# EasyEDA Pro project ProDoc_双路无刷电调_2025-08-21.epro, schematic Schematic1_1

## Sheets
1 P1: Board Name: Board1_1; Create Date: 2025-06-27; Page Name: P1; Project Name: AI8051U-AM32无刷电调; Schematic Name: Schematic1_1; Update Date: 2025-06-28; Company: 嘉立创EDA; Page Size: A4; Version: V1.0
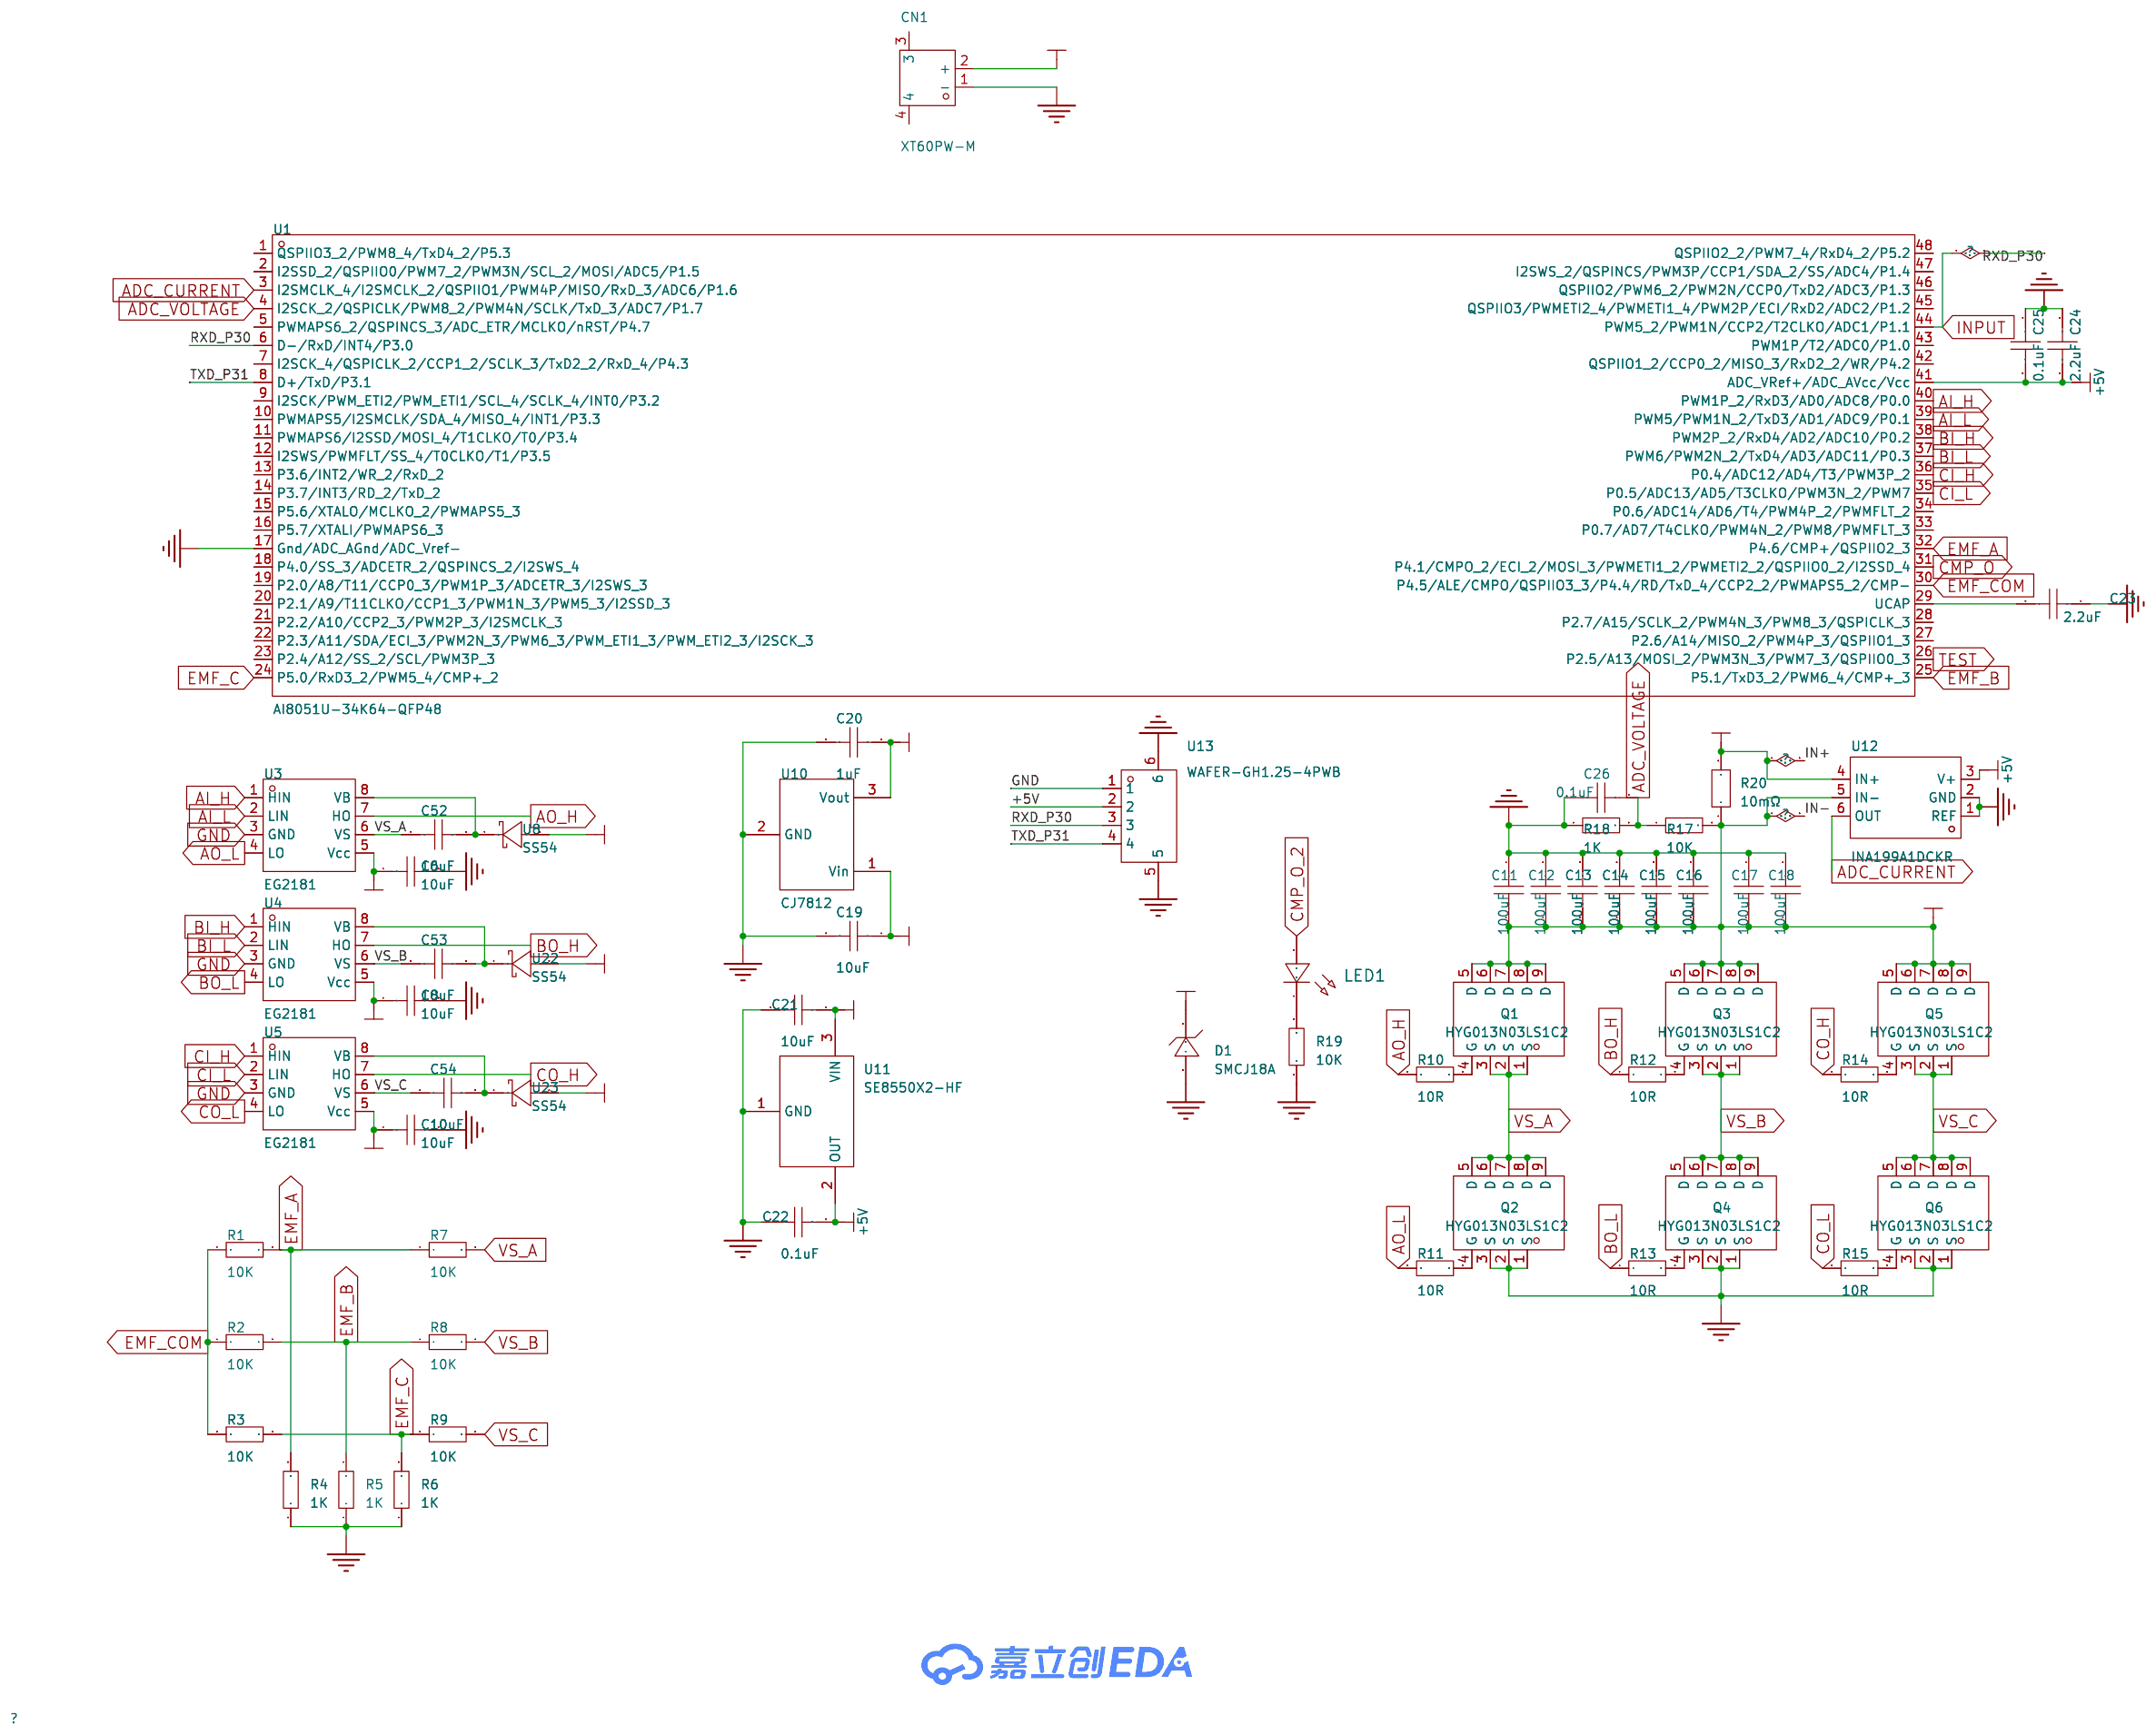
[diagram p0: P1]
2 P2: Page Name: P2
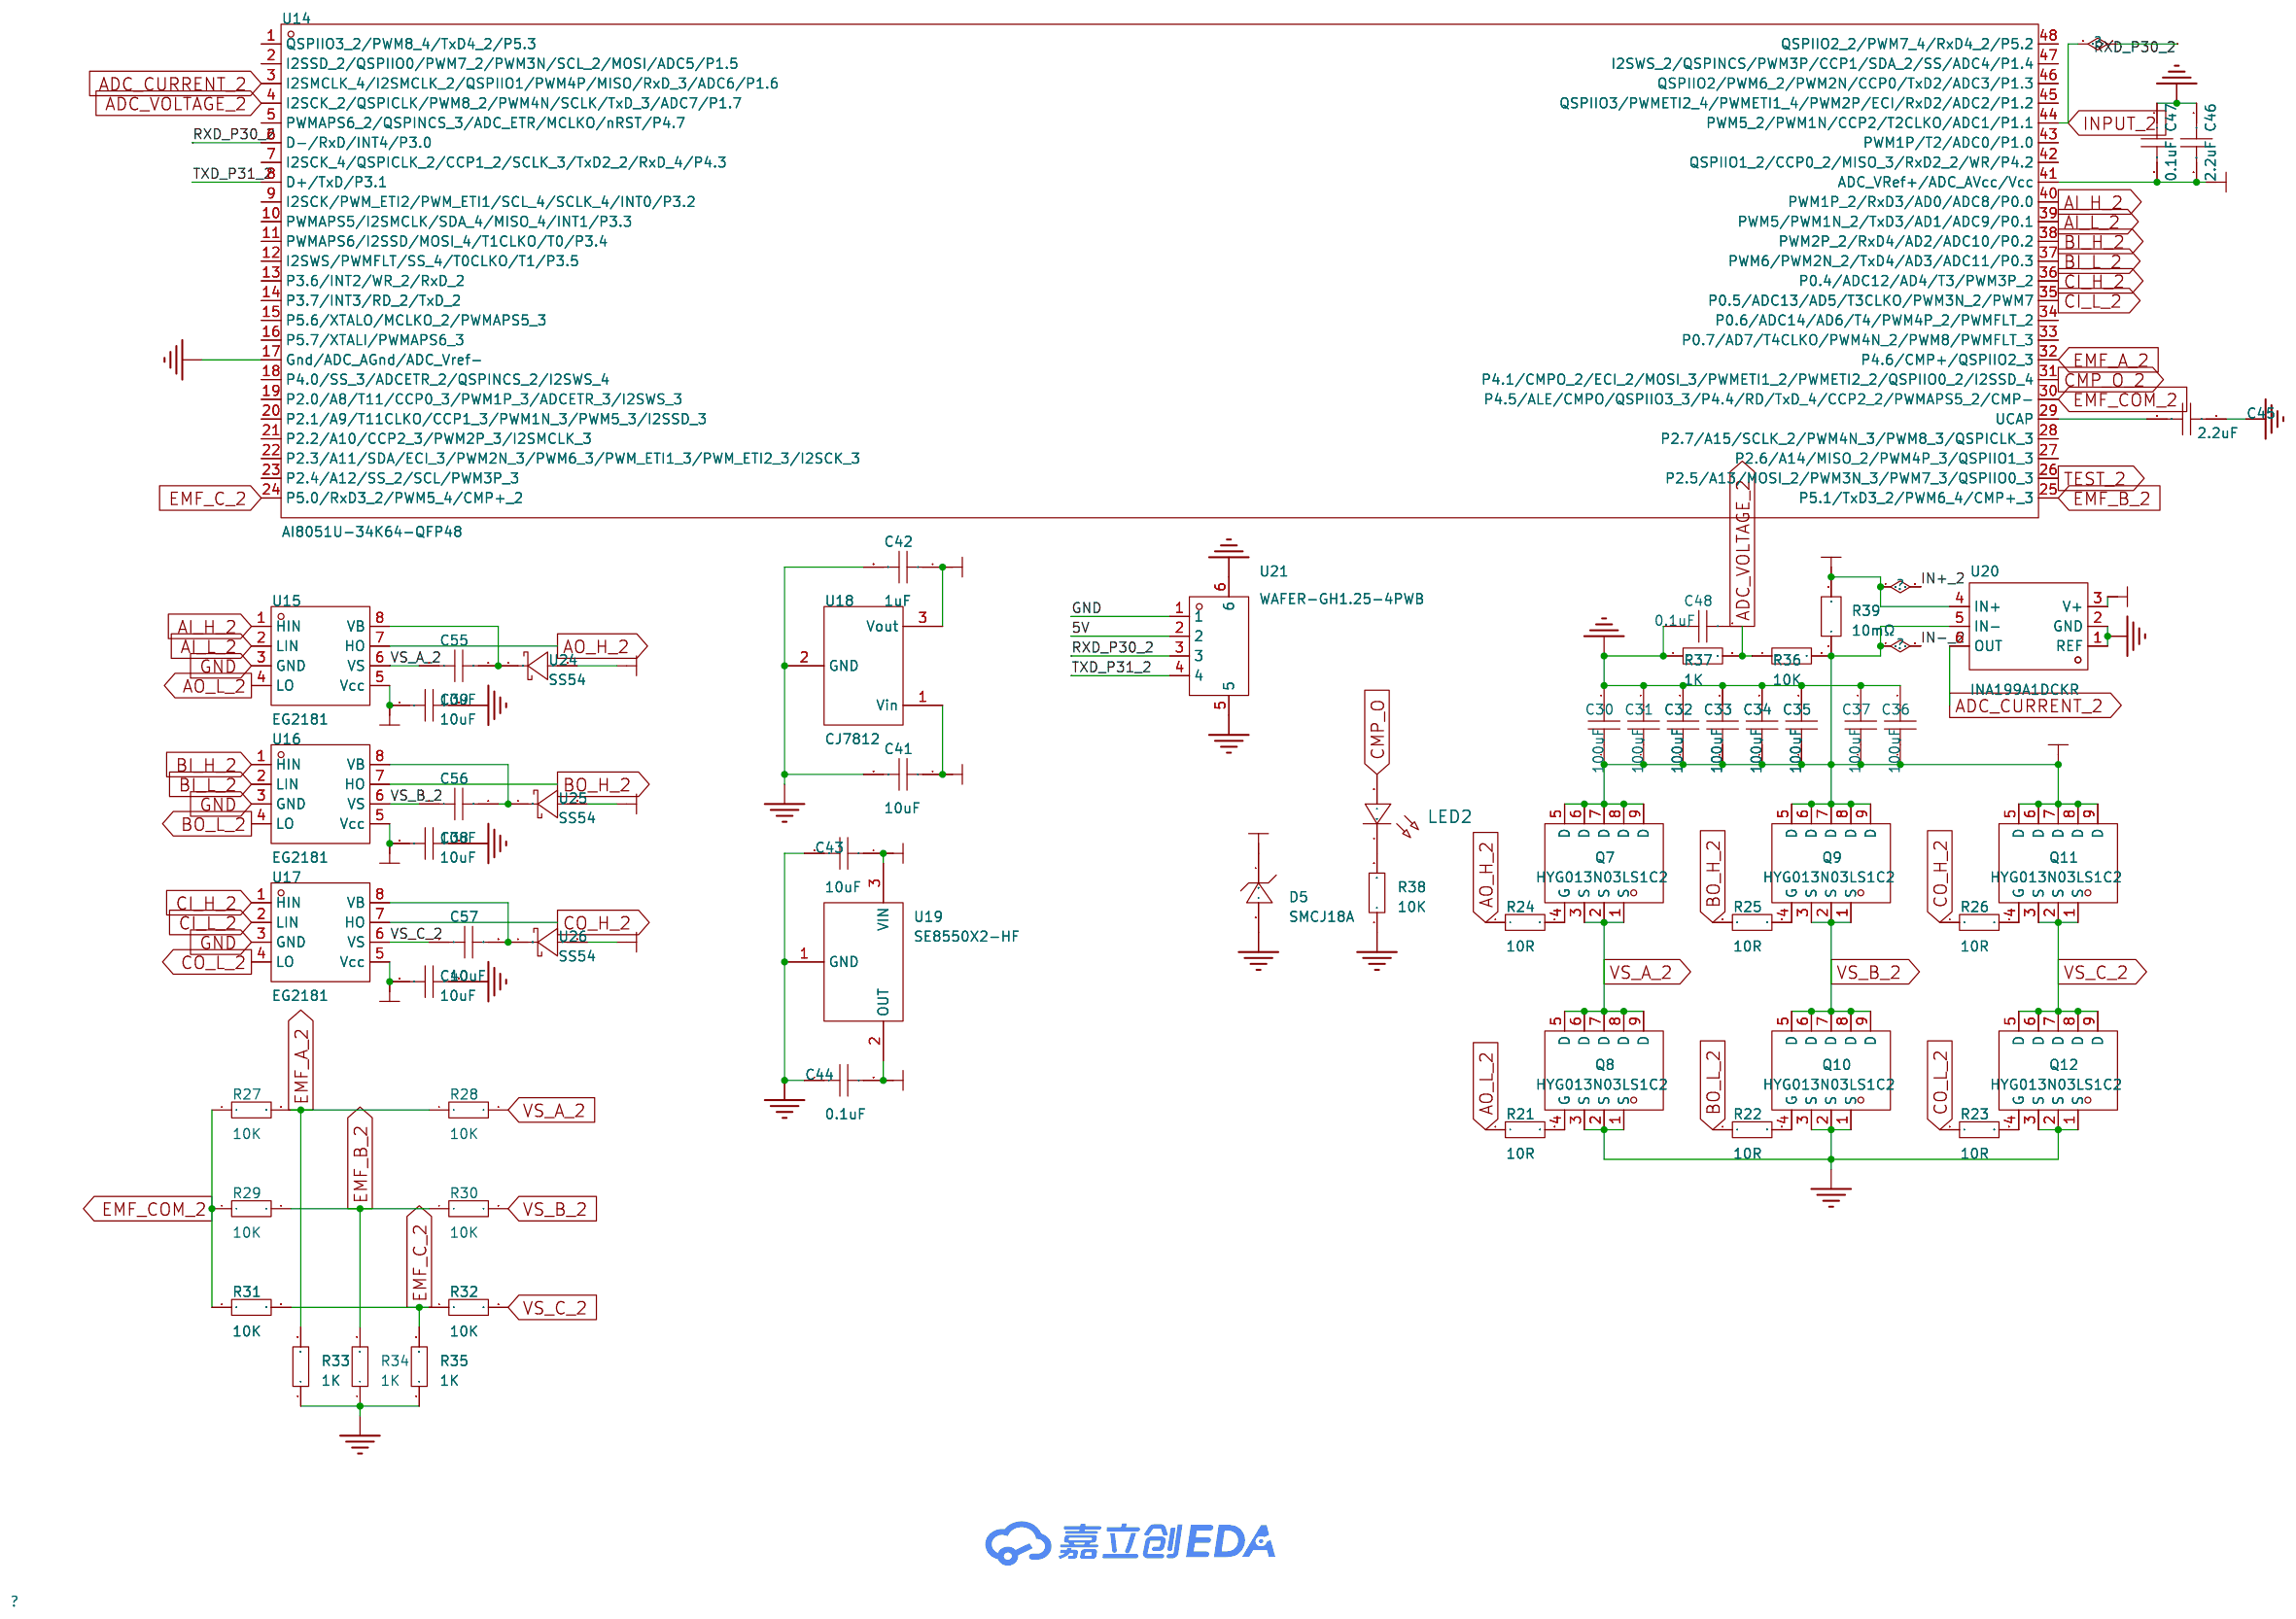
[diagram p1: P2]

## Parts
sheet P1
C6  10uF  [C0603]
C8  10uF  [C0603]
C10  10uF  [C0603]
C11  100uF  [C1206]
C12  100uF  [C1206]
C13  100uF  [C1206]
C14  100uF  [C1206]
C15  100uF  [C1206]
C16  100uF  [C1206]
C17  100uF  [C1206]
C18  100uF  [C1206]
C19  10uF  [C0603]
C20  1uF  [C0603]
C21  10uF  [C0603]
C22  0.1uF  [C0603]
C23  2.2uF  [C0603]
C24  2.2uF  [C0603]
C25  0.1uF  [C0603]
C26  0.1uF  [C0603]
C52  10uF  [C0603]
C53  10uF  [C0603]
C54  10uF  [C0603]
CN1  XT60PW-M  [CONN-TH_XT60PW-M]
D1  SMCJ18A  [SMC_L6.9-W5.9-LS7.9-RD]
LED1  -  [LED_0603]
Q1  HYG013N03LS1C2  [PDFN-8_L5.8-W5.1-P1.27-LS6.1-BL]
Q2  HYG013N03LS1C2  [PDFN-8_L5.8-W5.1-P1.27-LS6.1-BL]
Q3  HYG013N03LS1C2  [PDFN-8_L5.8-W5.1-P1.27-LS6.1-BL]
Q4  HYG013N03LS1C2  [PDFN-8_L5.8-W5.1-P1.27-LS6.1-BL]
Q5  HYG013N03LS1C2  [PDFN-8_L5.8-W5.1-P1.27-LS6.1-BL]
Q6  HYG013N03LS1C2  [PDFN-8_L5.8-W5.1-P1.27-LS6.1-BL]
R1  10K  [R0603]
R2  10K  [R0603]
R3  10K  [R0603]
R4  1K  [R0603]
R5  1K  [R0603]
R6  1K  [R0603]
R7  10K  [R0603]
R8  10K  [R0603]
R9  10K  [R0603]
R10  10R  [R0603]
R11  10R  [R0603]
R12  10R  [R0603]
R13  10R  [R0603]
R14  10R  [R0603]
R15  10R  [R0603]
R17  10K  [R0603]
R18  1K  [R0603]
R19  10K  [R0603]
R20  10mΩ  [RES-SMD_L6.4-W3.2-R2512]
U1  AI8051U-34K64-QFP48  [LQFP-48_L7.0-W7.0-P0.50-LS9.0-BL_1]
U3  EG2181  [SOP-8_L4.9-W3.9-P1.27-LS6.0-BL]
U4  EG2181  [SOP-8_L4.9-W3.9-P1.27-LS6.0-BL]
U5  EG2181  [SOP-8_L4.9-W3.9-P1.27-LS6.0-BL]
U8  SS54  [SMA_L4.2-W2.6-LS5.1-RD]
U10  CJ7812  [TO-252-3_L6.5-W5.8-P4.58-BL]
U11  SE8550X2-HF  [SOT-23-3_L2.9-W1.3-P1.90-LS2.4-BR]
U12  INA199A1DCKR  [SC-70-6_L2.2-W1.3-P0.65-LS2.1-BR]
U13  WAFER-GH1.25-4PWB  [CONN-SMD_4P-P1.25_XUNPU_WAFER-GH1.25-4PWB]
U22  SS54  [SMA_L4.2-W2.6-LS5.1-RD]
U23  SS54  [SMA_L4.2-W2.6-LS5.1-RD]
sheet P2
C30  100uF  [C1206]
C31  100uF  [C1206]
C32  100uF  [C1206]
C33  100uF  [C1206]
C34  100uF  [C1206]
C35  100uF  [C1206]
C36  100uF  [C1206]
C37  100uF  [C1206]
C38  10uF  [C0603]
C39  10uF  [C0603]
C40  10uF  [C0603]
C41  10uF  [C0603]
C42  1uF  [C0603]
C43  10uF  [C0603]
C44  0.1uF  [C0603]
C45  2.2uF  [C0603]
C46  2.2uF  [C0603]
C47  0.1uF  [C0603]
C48  0.1uF  [C0603]
C55  10uF  [C0603]
C56  10uF  [C0603]
C57  10uF  [C0603]
D5  SMCJ18A  [SMC_L6.9-W5.9-LS7.9-RD]
LED2  -  [LED_0603]
Q7  HYG013N03LS1C2  [PDFN-8_L5.8-W5.1-P1.27-LS6.1-BL]
Q8  HYG013N03LS1C2  [PDFN-8_L5.8-W5.1-P1.27-LS6.1-BL]
Q9  HYG013N03LS1C2  [PDFN-8_L5.8-W5.1-P1.27-LS6.1-BL]
Q10  HYG013N03LS1C2  [PDFN-8_L5.8-W5.1-P1.27-LS6.1-BL]
Q11  HYG013N03LS1C2  [PDFN-8_L5.8-W5.1-P1.27-LS6.1-BL]
Q12  HYG013N03LS1C2  [PDFN-8_L5.8-W5.1-P1.27-LS6.1-BL]
R21  10R  [R0603]
R22  10R  [R0603]
R23  10R  [R0603]
R24  10R  [R0603]
R25  10R  [R0603]
R26  10R  [R0603]
R27  10K  [R0603]
R28  10K  [R0603]
R29  10K  [R0603]
R30  10K  [R0603]
R31  10K  [R0603]
R32  10K  [R0603]
R33  1K  [R0603]
R34  1K  [R0603]
R35  1K  [R0603]
R36  10K  [R0603]
R37  1K  [R0603]
R38  10K  [R0603]
R39  10mΩ  [RES-SMD_L6.4-W3.2-R2512]
U14  AI8051U-34K64-QFP48  [LQFP-48_L7.0-W7.0-P0.50-LS9.0-BL_1]
U15  EG2181  [SOP-8_L4.9-W3.9-P1.27-LS6.0-BL]
U16  EG2181  [SOP-8_L4.9-W3.9-P1.27-LS6.0-BL]
U17  EG2181  [SOP-8_L4.9-W3.9-P1.27-LS6.0-BL]
U18  CJ7812  [TO-252-3_L6.5-W5.8-P4.58-BL]
U19  SE8550X2-HF  [SOT-23-3_L2.9-W1.3-P1.90-LS2.4-BR]
U20  INA199A1DCKR  [SC-70-6_L2.2-W1.3-P0.65-LS2.1-BR]
U21  WAFER-GH1.25-4PWB  [CONN-SMD_4P-P1.25_XUNPU_WAFER-GH1.25-4PWB]
U24  SS54  [SMA_L4.2-W2.6-LS5.1-RD]
U25  SS54  [SMA_L4.2-W2.6-LS5.1-RD]
U26  SS54  [SMA_L4.2-W2.6-LS5.1-RD]

## Library data of the parts
C6 C8 C10 C19-C26 C38-C48 = CAP_0603: Supplier Footprint: 0603
C11-C18 C30-C37 = CAP_1206: Supplier Footprint: 1206
C52-C57 = CL10A106MA8NRNC: 容值:10uF;精度:±20%;额定电压:25V;材质(温度系数):X5R;; LCSC Part Name: 10uF ±20% 25V; Supplier Part: C96446; Manufacturer: SAMSUNG(三星); Supplier Footprint: 0603; JLCPCB Part Class: 基础库; Datasheet: https://atta.szlcsc.com/upload/public/pdf/source/20160218/1457707763339.pdf; Supplier: LCSC; Tolerance: ±20%; Voltage Rated: 25V; Temperature Coefficient: X5R
CN1 = XT60PW-M: 类别:-;类型1:-;; LCSC Part Name: AMASS(艾迈斯)航模插头xt60连接器150公母对接pw锂电池公头 板插卧式XT60PW-M; Supplier Part: C98732; Manufacturer: AMASS(艾迈斯); JLCPCB Part Class: 扩展库; Datasheet: https://atta.szlcsc.com/upload/public/pdf/source/20240118/44A3DCFF53BE25DC65378AFFB21277A4.pdf; Supplier: LCSC; Type: 卧式插头; Colour: 黄色; InterfaceType: 公头
D1 D5 = SMCJ18A: 极性:单向;反向截止电压(Vrwm):18V;最大钳位电压:29.2V;峰值脉冲电流(Ipp):51.4A;峰值脉冲功率(Ppp):1.5kW;击穿电压:20V;; LCSC Part Name: TVS 18V截止 51.4A峰值脉冲; Supplier Part: C374030; Manufacturer: Littelfuse(美国力特); Supplier Footprint: DO-214AB(SMCJ); JLCPCB Part Class: 扩展库; Datasheet: https://atta.szlcsc.com/upload/public/pdf/source/20190918/C428836_E6B4B3834ADA1E56164A3D12F904E6C7.pdf; Supplier: LCSC; polarity: 单向; Reverse Stand-Off Voltage (Vrwm): 18V; Maximum Clamping Voltage: 29.2V; Peak Pulse Current (Ipp): 51.4A; Peak Pulse Power Dissipation (Ppp): 1.5kW; Breakdown Voltage: 20V; Type: TVS
LED1 LED2 = LED_0603-R: Supplier Footprint: 0603
Q1-Q12 = HYG013N03LS1C2: 类型:-;漏源电压(Vdss):30V;连续漏极电流(Id):150A;导通电阻(RDS(on)@Vgs,Id):2mΩ@4.5V,20A;功率:65W;阈值电压(Vgs(th)@Id):1V@250uA;; LCSC Part Name: 单通道N沟道MOSFET,电流:150A,耐压:30V; Supplier Part: C2763405; Manufacturer: HUAYI(华羿微); Supplier Footprint: PDFN-8(5.1x5.8); JLCPCB Part Class: 扩展库; Datasheet: https://atta.szlcsc.com/upload/public/pdf/source/20210326/C2763405_0A6080D7BBB9C26F30CE39A27C6AD564.pdf; Supplier: LCSC; Drain Source Voltage (Vdss): 30V; Continuous Drain Current (Id): 150A; Drain Source On Resistance (RDS(on)@Vgs,Id): 2mΩ@4.5V,20A; Power Dissipation (Pd): 65W; Gate Threshold Voltage (Vgs(th)@Id): 1V@250uA; Total Gate Charge (Qg@Vgs): 44.7nC@10V; Input Capacitance (Ciss@Vds): 3.011nF; Reverse Transfer Capacitance (Crss@Vds): 9.2pF@25V; Operating Temperature: -55℃~+175℃
R1-R15 R17-R19 R21-R38 = Res_0603: Supplier Footprint: 0603
R20 R39 = HoJLR2512-3W-10mR-1%: 电阻类型:采样电阻;阻值:10mΩ;精度:±1%;功率:3W;安装方式:贴片;; LCSC Part Name: 10mΩ ±1% 3W; Supplier Part: C2903468; Manufacturer: Milliohm(毫欧); Supplier Footprint: 2512; JLCPCB Part Class: 扩展库; Datasheet: https://atta.szlcsc.com/upload/public/pdf/source/20211009/7525CABAB363C979E942C1DD41F1FEF0.pdf; Supplier: LCSC; Type: 采样电阻; Tolerance: ±1%; Power(Watts): 3W; Mounting Sytle: 贴片
U1 U14 = AI8051U-34K64-QFP48: 硬件浮点/硬件三角函数 跑100MHz, 32位8051-CPU 跑 42MHz，PWM 有硬件移相功能，DMA支持外设到外设，DMA支持PWM; Supplier Part: C41427635; Manufacturer: STC; Supplier Footprint: QFP-48; JLCPCB Part Class: 扩展库; Datasheet: https://atta.szlcsc.com/upload/public/pdf/source/20241012/98E0A3F17C9CC280218AE3F266CCDE47.pdf; Supplier: LCSC
U3-U5 U15-U17 = EG2181: Supplier Part: C459721; Manufacturer: EG(屹晶微); Supplier Footprint: SOP-8; JLCPCB Part Class: 扩展库; Datasheet: https://atta.szlcsc.com/upload/public/pdf/source/20191122/C459721_8DDE7F395482F041919AB19A4C4FD510.pdf; Supplier: LCSC
U8 U22-U26 = SS54: Supplier Part: C9900023219; Supplier Footprint: (1N5824)DO-214; JLCPCB Part Class: 扩展库; Supplier: LCSC
U10 U18 = CJ7812_C26184: 输出类型:固定;最大输入电压:35V;输出电压:12V;输出电流:1.5A;输出极性:正极;; LCSC Part Name: 输入35V 输出12V 1.5A; Supplier Part: C26184; Manufacturer: CJ(江苏长电/长晶); Supplier Footprint: TO-252-2; JLCPCB Part Class: 扩展库; Datasheet: https://atta.szlcsc.com/upload/public/pdf/source/20180412/C26184_C7F45D4504ECDF2F14935BA96F015906.pdf; Supplier: LCSC; Output Type: 固定; Maximum Input Voltage: 35V; Output Voltage: 12V; Output Current: 1.5A; Dropout Voltage: 2V@(1A); Output Polarity: 正极; Number of Outputs: 1
U11 U19 = SE8550X2-HF: 输出类型:固定;最大输入电压:40V;输出电压:5V;最大输出电流:250mA;电源纹波抑制比(PSRR):85dB;输出极性:正极;; LCSC Part Name: 输入40V 输出5V 250mA; Supplier Part: C115015; Manufacturer: SEAWARD(思旺); Supplier Footprint: SOT-23; JLCPCB Part Class: 扩展库; Datasheet: https://atta.szlcsc.com/upload/public/pdf/source/20221228/060EFB5038ABEFFCA582915343CD15E2.pdf; Supplier: LCSC; Output Type: 固定; Maximum Input Voltage: 40V; Output Voltage: 5V; MAX Output Current: 250mA; Power Supply Rejection Ratio (PSRR): 85dB; Dropout Voltage: 600mV@(200mA); standby current: 2uA; Output Polarity: 正极; Number of Outputs: 1
U12 U20 = INA199A1DCKR: INA199 26V、双向电流感应放大器; Supplier Part: C59135; Manufacturer: TI(德州仪器); Supplier Footprint: SOT-363(SC-70-6); JLCPCB Part Class: 扩展库; Datasheet: https://www.ti.com/cn/lit/gpn/ina199; Supplier: LCSC; Supply Voltage: -300mV~26V; Supply Current: 300uA; Operating Temperature: -40℃~+125℃
U13 U21 = WAFER-GH1.25-4PWB: 插针结构:1x4P;间距:1.25mm;安装方式:卧贴;参考系列:GH;总PIN数:4P;排数:1;每排PIN数:4;行距:-;额定电流:1A;触头材质:黄铜;触头镀层:-;工作温度范围:-25℃~+85℃;; LCSC Part Name: 1x4P 间距:1.25mm 卧贴 系列:GH; Supplier Part: C3029379; Manufacturer: XUNPU(讯普); Supplier Footprint: SMD,P=1.25mm,卧贴; JLCPCB Part Class: 扩展库; Datasheet: https://atta.szlcsc.com/upload/public/pdf/source/20220527/CB8773BFB0913C3B8ABD62CB38BA101A.pdf; Supplier: LCSC; Pins Structure: 1x4P; Pitch: 1.25mm; Mounting Type: 卧贴; Reference Series: GH; Number of Pins: 4P; Number of Rows: 1; Number of PINs Per Row: 4; Current Rating: 1A; Contact Material: 黄铜; Operating Temperature: -25℃~+85℃; Voltage Rating: 125V; Plastic Material: LCP; Supplementary Features: 辅助焊脚; Color: 米色; Z-Height of the Board: 4.35mm; X-Length of Bottom Edge on Board (Spacing Line): 8.25mm; Y-Width of Bottom Edge on Board: 5mm

## Nets
5V: C44.2 C46.2 C47.2 U14.41(ADC_VRef+/ADC_AVcc/Vcc) U19.2(OUT) U20.3(V+) U21.2
12V: C38.1 C39.1 C40.1 C42.1 C43.1 U15.5(Vcc) U16.5(Vcc) U17.5(Vcc) U18.3(Vout) U19.3(VIN) U24.2(A) U25.2(A) U26.2(A)
+5V: C22.2 C24.2 C25.2 U1.41(ADC_VRef+/ADC_AVcc/Vcc) U11.2(OUT) U12.3(V+) U13.2
+12V: C6.1 C8.1 C10.1 C20.1 C21.1 U3.5(Vcc) U4.5(Vcc) U5.5(Vcc) U8.2(A) U10.3(Vout) U11.3(VIN) U22.2(A) U23.2(A)
GND: C6.2 C8.2 C10.2 C11.2 C12.2 C13.2 C14.2 C15.2 C16.2 C17.2 C18.2 C19.2 C20.2 C21.2 C22.1 C23.1 C24.1 C25.1 C26.1 C30.2 C31.2 C32.2 C33.2 C34.2 C35.2 C36.2 C37.2 C38.2 C39.2 C40.2 C41.2 C42.2 C43.2 C44.1 C45.1 C46.1 C47.1 C48.1 CN1.1(-) D1.2(A) D5.2(A) Q2.1(S) Q2.2(S) Q2.3(S) Q4.1(S) Q4.2(S) Q4.3(S) Q6.1(S) Q6.2(S) Q6.3(S) Q8.1(S) Q8.2(S) Q8.3(S) Q10.1(S) Q10.2(S) Q10.3(S) Q12.1(S) Q12.2(S) Q12.3(S) R4.1 R5.1 R6.1 R18.1 R19.1 R33.1 R34.1 R35.1 R37.1 R38.1 U1.17(Gnd/ADC_AGnd/ADC_Vref-) U3.3(GND) U4.3(GND) U5.3(GND) U10.2(GND) U11.1(GND) U12.1(REF) U12.2(GND) U13.1 U13.5 U13.6 U14.17(Gnd/ADC_AGnd/ADC_Vref-) U15.3(GND) U16.3(GND) U17.3(GND) U18.2(GND) U19.1(GND) U20.1(REF) U20.2(GND) U21.1 U21.5 U21.6
VBAT: C19.1 C41.1 CN1.2(+) R20.2 R39.2 U10.1(Vin) U12.4(IN+) U18.1(Vin) U20.4(IN+)
ADC_CURRENT: U1.3(I2SMCLK_4/I2SMCLK_2/QSPIIO1/PWM4P/MISO/RxD_3/ADC6/P1.6) U12.6(OUT)
ADC_CURRENT_2: U14.3(I2SMCLK_4/I2SMCLK_2/QSPIIO1/PWM4P/MISO/RxD_3/ADC6/P1.6) U20.6(OUT)
ADC_VOLTAGE: C26.2 R17.1 R18.2 U1.4(I2SCK_2/QSPICLK/PWM8_2/PWM4N/SCLK/TxD_3/ADC7/P1.7)
ADC_VOLTAGE_2: C48.2 R36.1 R37.2 U14.4(I2SCK_2/QSPICLK/PWM8_2/PWM4N/SCLK/TxD_3/ADC7/P1.7)
AI_H: U1.40(PWM1P_2/RxD3/AD0/ADC8/P0.0) U3.1(HIN)
AI_H_2: U14.40(PWM1P_2/RxD3/AD0/ADC8/P0.0) U15.1(HIN)
AI_L: U1.39(PWM5/PWM1N_2/TxD3/AD1/ADC9/P0.1) U3.2(LIN)
AI_L_2: U14.39(PWM5/PWM1N_2/TxD3/AD1/ADC9/P0.1) U15.2(LIN)
AO_H: R10.1 U3.7(HO)
AO_H_2: R24.1 U15.7(HO)
AO_L: R11.1 U3.4(LO)
AO_L_2: R21.1 U15.4(LO)
BI_H: U1.38(PWM2P_2/RxD4/AD2/ADC10/P0.2) U4.1(HIN)
BI_H_2: U14.38(PWM2P_2/RxD4/AD2/ADC10/P0.2) U16.1(HIN)
BI_L: U1.37(PWM6/PWM2N_2/TxD4/AD3/ADC11/P0.3) U4.2(LIN)
BI_L_2: U14.37(PWM6/PWM2N_2/TxD4/AD3/ADC11/P0.3) U16.2(LIN)
BO_H: R12.1 U4.7(HO)
BO_H_2: R25.1 U16.7(HO)
BO_L: R13.1 U4.4(LO)
BO_L_2: R22.1 U16.4(LO)
CI_H: U1.36(P0.4/ADC12/AD4/T3/PWM3P_2) U5.1(HIN)
CI_H_2: U14.36(P0.4/ADC12/AD4/T3/PWM3P_2) U17.1(HIN)
CI_L: U1.35(P0.5/ADC13/AD5/T3CLKO/PWM3N_2/PWM7) U5.2(LIN)
CI_L_2: U14.35(P0.5/ADC13/AD5/T3CLKO/PWM3N_2/PWM7) U17.2(LIN)
CMP_O: LED2.2(A) U1.31(P4.1/CMPO_2/ECI_2/MOSI_3/PWMETI1_2/PWMETI2_2/QSPIIO0_2/I2SSD_4)
CMP_O_2: LED1.2(A) U14.31(P4.1/CMPO_2/ECI_2/MOSI_3/PWMETI1_2/PWMETI2_2/QSPIIO0_2/I2SSD_4)
CO_H: R14.1 U5.7(HO)
CO_H_2: R26.1 U17.7(HO)
CO_L: R15.1 U5.4(LO)
CO_L_2: R23.1 U17.4(LO)
EMF_A: R1.2 R4.2 R7.1 U1.32(P4.6/CMP+/QSPIIO2_3)
EMF_A_2: R27.2 R28.1 R33.2 U14.32(P4.6/CMP+/QSPIIO2_3)
EMF_B: R2.2 R5.2 R8.1 U1.25(P5.1/TxD3_2/PWM6_4/CMP+_3)
EMF_B_2: R29.2 R30.1 R34.2 U14.25(P5.1/TxD3_2/PWM6_4/CMP+_3)
EMF_C: R3.2 R6.2 R9.1 U1.24(P5.0/RxD3_2/PWM5_4/CMP+_2)
EMF_C_2: R31.2 R32.1 R35.2 U14.24(P5.0/RxD3_2/PWM5_4/CMP+_2)
EMF_COM: R1.1 R2.1 R3.1 U1.30(P4.5/ALE/CMPO/QSPIIO3_3/P4.4/RD/TxD_4/CCP2_2/PWMAPS5_2/CMP-)
EMF_COM_2: R27.1 R29.1 R31.1 U14.30(P4.5/ALE/CMPO/QSPIIO3_3/P4.4/RD/TxD_4/CCP2_2/PWMAPS5_2/CMP-)
INPUT: U1.6(D-/RxD/INT4/P3.0) U1.44(PWM5_2/PWM1N/CCP2/T2CLKO/ADC1/P1.1) U13.3
INPUT_2: U14.6(D-/RxD/INT4/P3.0) U14.44(PWM5_2/PWM1N/CCP2/T2CLKO/ADC1/P1.1) U21.3
TEST: U1.26(P2.5/A13/MOSI_2/PWM3N_3/PWM7_3/QSPIIO0_3)
TEST_2: U14.26(P2.5/A13/MOSI_2/PWM3N_3/PWM7_3/QSPIIO0_3)
TXD_P31: U1.8(D+/TxD/P3.1) U13.4
TXD_P31_2: U14.8(D+/TxD/P3.1) U21.4
V_MOS: C11.1 C12.1 C13.1 C14.1 C15.1 C16.1 C17.1 C18.1 D1.1(C) Q1.5(D) Q1.6(D) Q1.7(D) Q1.8(D) Q1.9(D) Q3.5(D) Q3.6(D) Q3.7(D) Q3.8(D) Q3.9(D) Q5.5(D) Q5.6(D) Q5.7(D) Q5.8(D) Q5.9(D) R17.2 R20.1 U12.5(IN-)
V_MOS_2: C30.1 C31.1 C32.1 C33.1 C34.1 C35.1 C36.1 C37.1 D5.1(C) Q7.5(D) Q7.6(D) Q7.7(D) Q7.8(D) Q7.9(D) Q9.5(D) Q9.6(D) Q9.7(D) Q9.8(D) Q9.9(D) Q11.5(D) Q11.6(D) Q11.7(D) Q11.8(D) Q11.9(D) R36.2 R39.1 U20.5(IN-)
VS_A: C52.1 Q1.1(S) Q1.2(S) Q1.3(S) Q2.5(D) Q2.6(D) Q2.7(D) Q2.8(D) Q2.9(D) R7.2 U3.6(VS)
VS_A_2: C55.1 Q7.1(S) Q7.2(S) Q7.3(S) Q8.5(D) Q8.6(D) Q8.7(D) Q8.8(D) Q8.9(D) R28.2 U15.6(VS)
VS_B: C53.1 Q3.1(S) Q3.2(S) Q3.3(S) Q4.5(D) Q4.6(D) Q4.7(D) Q4.8(D) Q4.9(D) R8.2 U4.6(VS)
VS_B_2: C56.1 Q9.1(S) Q9.2(S) Q9.3(S) Q10.5(D) Q10.6(D) Q10.7(D) Q10.8(D) Q10.9(D) R30.2 U16.6(VS)
VS_C: C54.1 Q5.1(S) Q5.2(S) Q5.3(S) Q6.5(D) Q6.6(D) Q6.7(D) Q6.8(D) Q6.9(D) R9.2 U5.6(VS)
VS_C_2: C57.1 Q11.1(S) Q11.2(S) Q11.3(S) Q12.5(D) Q12.6(D) Q12.7(D) Q12.8(D) Q12.9(D) R32.2 U17.6(VS)
$1N2898: Q2.4(G) R11.2
$1N2899: Q4.4(G) R13.2
$1N2900: Q6.4(G) R15.2
$1N2901: Q1.4(G) R10.2
$1N2902: Q3.4(G) R12.2
$1N2903: Q5.4(G) R14.2
$1N2950: C53.2 U4.8(VB) U22.1(C)
$1N2954: C54.2 U5.8(VB) U23.1(C)
$1N2971: C23.2 U1.29(UCAP)
$1N2984: C52.2 U3.8(VB) U8.1(C)
$1N2992: LED1.1(C) R19.2
$2N6146: C45.2 U14.29(UCAP)
$2N6183: Q11.4(G) R26.2
$2N6187: Q7.4(G) R24.2
$2N6190: Q9.4(G) R25.2
$2N6208: LED2.1(C) R38.2
$2N6226: Q10.4(G) R22.2
$2N6227: Q12.4(G) R23.2
$2N6229: Q8.4(G) R21.2
$2N6248: C56.2 U16.8(VB) U25.1(C)
$2N6252: C55.2 U15.8(VB) U24.1(C)
$2N6253: C57.2 U17.8(VB) U26.1(C)

Not connected (* = marked no-connect by the designer): CN1 3 4; U1 1(QSPIIO3_2/PWM8_4/TxD4_2/P5.3) 2(I2SSD_2/QSPIIO0/PWM7_2/PWM3N/SCL_2/MOSI/ADC5/P1.5) 5(PWMAPS6_2/QSPINCS_3/ADC_ETR/MCLKO/nRST/P4.7) 7(I2SCK_4/QSPICLK_2/CCP1_2/SCLK_3/TxD2_2/RxD_4/P4.3) 9(I2SCK/PWM_ETI2/PWM_ETI1/SCL_4/SCLK_4/INT0/P3.2) 10(PWMAPS5/I2SMCLK/SDA_4/MISO_4/INT1/P3.3) 11(PWMAPS6/I2SSD/MOSI_4/T1CLKO/T0/P3.4) 12(I2SWS/PWMFLT/SS_4/T0CLKO/T1/P3.5) 13(P3.6/INT2/WR_2/RxD_2) 14(P3.7/INT3/RD_2/TxD_2) 15(P5.6/XTALO/MCLKO_2/PWMAPS5_3) 16(P5.7/XTALI/PWMAPS6_3) 18(P4.0/SS_3/ADCETR_2/QSPINCS_2/I2SWS_4) 19(P2.0/A8/T11/CCP0_3/PWM1P_3/ADCETR_3/I2SWS_3) 20(P2.1/A9/T11CLKO/CCP1_3/PWM1N_3/PWM5_3/I2SSD_3) 21(P2.2/A10/CCP2_3/PWM2P_3/I2SMCLK_3) 22(P2.3/A11/SDA/ECI_3/PWM2N_3/PWM6_3/PWM_ETI1_3/PWM_ETI2_3/I2SCK_3) 23(P2.4/A12/SS_2/SCL/PWM3P_3) 27(P2.6/A14/MISO_2/PWM4P_3/QSPIIO1_3) 28(P2.7/A15/SCLK_2/PWM4N_3/PWM8_3/QSPICLK_3) 33(P0.7/AD7/T4CLKO/PWM4N_2/PWM8/PWMFLT_3) 34(P0.6/ADC14/AD6/T4/PWM4P_2/PWMFLT_2) 42(QSPIIO1_2/CCP0_2/MISO_3/RxD2_2/WR/P4.2) 43(PWM1P/T2/ADC0/P1.0) 45(QSPIIO3/PWMETI2_4/PWMETI1_4/PWM2P/ECI/RxD2/ADC2/P1.2) 46(QSPIIO2/PWM6_2/PWM2N/CCP0/TxD2/ADC3/P1.3) 47(I2SWS_2/QSPINCS/PWM3P/CCP1/SDA_2/SS/ADC4/P1.4) 48(QSPIIO2_2/PWM7_4/RxD4_2/P5.2); U14 1(QSPIIO3_2/PWM8_4/TxD4_2/P5.3) 2(I2SSD_2/QSPIIO0/PWM7_2/PWM3N/SCL_2/MOSI/ADC5/P1.5) 5(PWMAPS6_2/QSPINCS_3/ADC_ETR/MCLKO/nRST/P4.7) 7(I2SCK_4/QSPICLK_2/CCP1_2/SCLK_3/TxD2_2/RxD_4/P4.3) 9(I2SCK/PWM_ETI2/PWM_ETI1/SCL_4/SCLK_4/INT0/P3.2) 10(PWMAPS5/I2SMCLK/SDA_4/MISO_4/INT1/P3.3) 11(PWMAPS6/I2SSD/MOSI_4/T1CLKO/T0/P3.4) 12(I2SWS/PWMFLT/SS_4/T0CLKO/T1/P3.5) 13(P3.6/INT2/WR_2/RxD_2) 14(P3.7/INT3/RD_2/TxD_2) 15(P5.6/XTALO/MCLKO_2/PWMAPS5_3) 16(P5.7/XTALI/PWMAPS6_3) 18(P4.0/SS_3/ADCETR_2/QSPINCS_2/I2SWS_4) 19(P2.0/A8/T11/CCP0_3/PWM1P_3/ADCETR_3/I2SWS_3) 20(P2.1/A9/T11CLKO/CCP1_3/PWM1N_3/PWM5_3/I2SSD_3) 21(P2.2/A10/CCP2_3/PWM2P_3/I2SMCLK_3) 22(P2.3/A11/SDA/ECI_3/PWM2N_3/PWM6_3/PWM_ETI1_3/PWM_ETI2_3/I2SCK_3) 23(P2.4/A12/SS_2/SCL/PWM3P_3) 27(P2.6/A14/MISO_2/PWM4P_3/QSPIIO1_3) 28(P2.7/A15/SCLK_2/PWM4N_3/PWM8_3/QSPICLK_3) 33(P0.7/AD7/T4CLKO/PWM4N_2/PWM8/PWMFLT_3) 34(P0.6/ADC14/AD6/T4/PWM4P_2/PWMFLT_2) 42(QSPIIO1_2/CCP0_2/MISO_3/RxD2_2/WR/P4.2) 43(PWM1P/T2/ADC0/P1.0) 45(QSPIIO3/PWMETI2_4/PWMETI1_4/PWM2P/ECI/RxD2/ADC2/P1.2) 46(QSPIIO2/PWM6_2/PWM2N/CCP0/TxD2/ADC3/P1.3) 47(I2SWS_2/QSPINCS/PWM3P/CCP1/SDA_2/SS/ADC4/P1.4) 48(QSPIIO2_2/PWM7_4/RxD4_2/P5.2)
